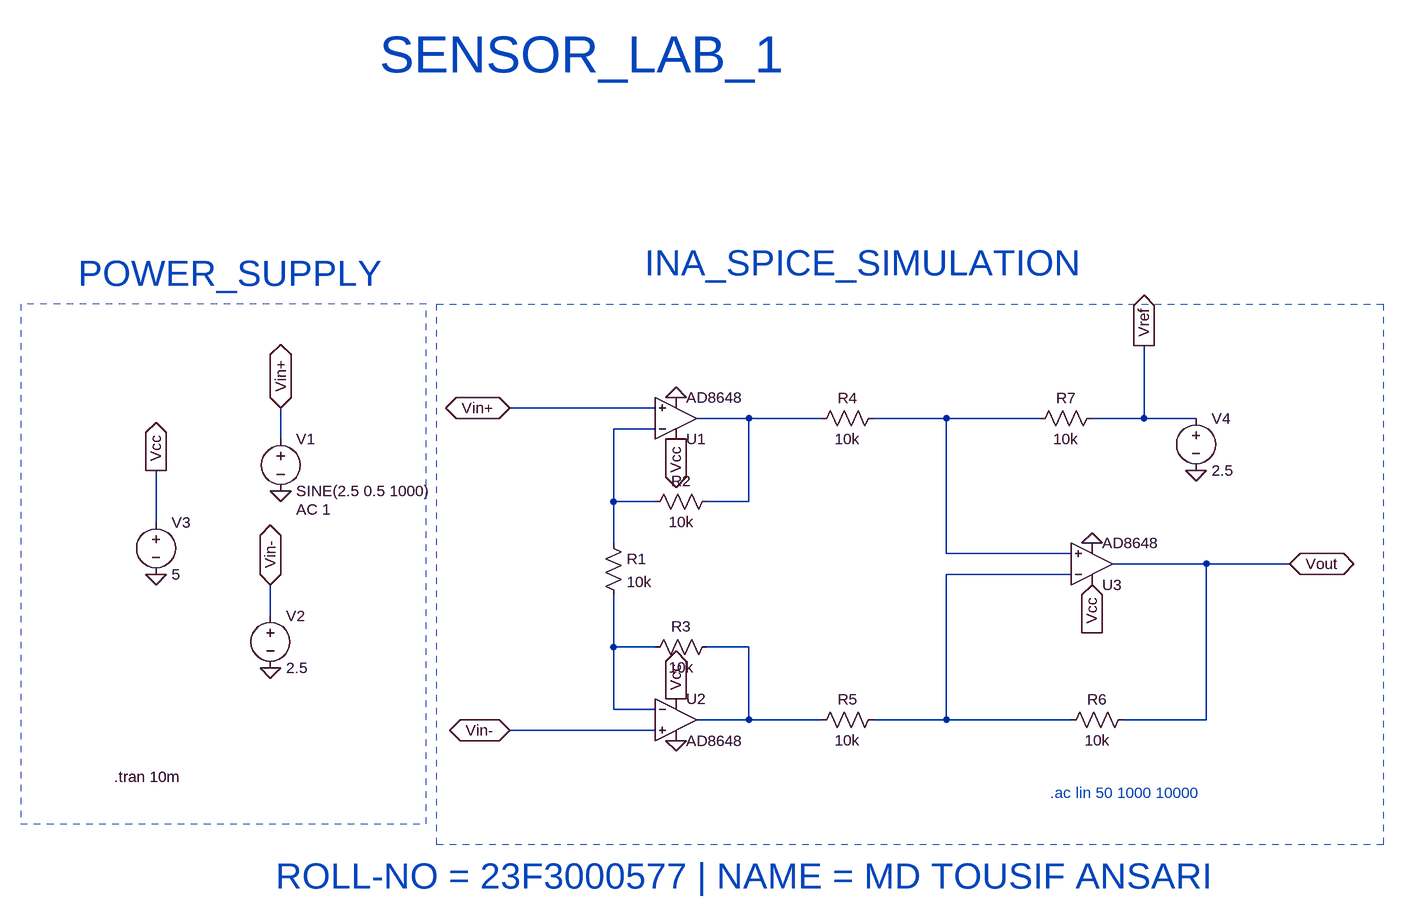
[diagram p0: schematic INST_AMP_2.asc]
INST_AMP_2.asc, the LTspice schematic file:
Version 4.1
SHEET 1 1604 772
WIRE 96 16 -128 16
WIRE 240 32 160 32
WIRE 352 32 240 32
WIRE 544 32 432 32
WIRE 688 32 544 32
WIRE 848 32 848 -80
WIRE 848 32 768 32
WIRE 928 32 848 32
WIRE 96 48 32 48
WIRE -480 64 -480 16
WIRE 32 160 32 48
WIRE 96 160 32 160
WIRE 240 160 240 32
WIRE 240 160 176 160
WIRE -672 192 -672 112
WIRE 32 224 32 160
WIRE 544 240 544 32
WIRE 736 240 544 240
WIRE 944 256 800 256
WIRE 1072 256 944 256
WIRE 736 272 544 272
WIRE -496 336 -496 288
WIRE 32 384 32 304
WIRE 96 384 32 384
WIRE 240 384 176 384
WIRE 32 480 32 384
WIRE 96 480 32 480
WIRE 240 496 240 384
WIRE 240 496 160 496
WIRE 352 496 240 496
WIRE 544 496 544 272
WIRE 544 496 432 496
WIRE 736 496 544 496
WIRE 944 496 944 256
WIRE 944 496 816 496
WIRE 96 512 -128 512
FLAG 128 0 0
FLAG 128 528 0
FLAG -480 144 0
FLAG -496 416 0
FLAG -672 272 0
FLAG -672 112 Vcc
IOPIN -672 112 Out
FLAG 128 64 Vcc
IOPIN 128 64 Out
FLAG 128 464 Vcc
IOPIN 128 464 Out
FLAG -480 16 Vin+
IOPIN -480 16 BiDir
FLAG -496 288 Vin-
IOPIN -496 288 BiDir
FLAG -128 16 Vin+
IOPIN -128 16 BiDir
FLAG -128 512 Vin-
IOPIN -128 512 BiDir
FLAG 1072 256 Vout
IOPIN 1072 256 BiDir
FLAG 768 288 Vcc
IOPIN 768 288 In
FLAG 768 224 0
FLAG 848 -80 Vref
IOPIN 848 -80 Out
FLAG 928 112 0
SYMBOL OpAmps\\AD8648 128 432 R0
SYMATTR InstName U2
SYMBOL OpAmps\\AD8648 128 96 M180
SYMATTR InstName U1
SYMBOL res 16 208 R0
SYMATTR InstName R1
SYMATTR Value 10k
SYMBOL res 192 144 R90
WINDOW 0 0 56 VBottom 2
WINDOW 3 32 56 VTop 2
SYMATTR InstName R2
SYMATTR Value 10k
SYMBOL res 192 368 R90
WINDOW 0 0 56 VBottom 2
WINDOW 3 32 56 VTop 2
SYMATTR InstName R3
SYMATTR Value 10k
SYMBOL res 448 16 R90
WINDOW 0 0 56 VBottom 2
WINDOW 3 32 56 VTop 2
SYMATTR InstName R4
SYMATTR Value 10k
SYMBOL res 448 480 R90
WINDOW 0 0 56 VBottom 2
WINDOW 3 32 56 VTop 2
SYMATTR InstName R5
SYMATTR Value 10k
SYMBOL res 784 16 R90
WINDOW 0 0 56 VBottom 2
WINDOW 3 32 56 VTop 2
SYMATTR InstName R7
SYMATTR Value 10k
SYMBOL voltage -480 48 R0
WINDOW 123 24 124 Left 2
WINDOW 39 0 0 Left 0
SYMATTR Value2 AC 1
SYMATTR InstName V1
SYMATTR Value SINE(2.5 0.5 1000)
SYMBOL voltage -496 320 R0
SYMATTR InstName V2
SYMATTR Value 2.5
SYMBOL voltage -672 176 R0
SYMATTR InstName V3
SYMATTR Value 5
SYMBOL OpAmps\\AD8648 768 320 M180
SYMATTR InstName U3
SYMBOL res 832 480 R90
WINDOW 0 0 56 VBottom 2
WINDOW 3 32 56 VTop 2
SYMATTR InstName R6
SYMATTR Value 10k
SYMBOL voltage 928 16 R0
SYMATTR InstName V4
SYMATTR Value 2.5
TEXT -736 584 Left 2 !.tran 10m
TEXT 704 608 Left 2 ;.ac lin 50 1000 10000
TEXT -792 -192 Left 5 ;POWER_SUPPLY
TEXT 80 -208 Left 5 ;INA_SPICE_SIMULATION
TEXT -328 -528 Left 6 ;SENSOR_LAB_1
TEXT -488 736 Left 5 ;ROLL-NO = 23F3000577 | NAME = MD TOUSIF ANSARI
RECTANGLE Normal -880 656 -256 -144 2
RECTANGLE Normal 1216 688 -240 -144 2

The netlist it stands for:
* INST_AMP_2.asc
X§U2 Vin- N005 Vcc 0 N006 AD8648  ; pins In+ In- V+ V- OUT
X§U1 Vin+ N003 Vcc 0 N001 AD8648  ; pins In+ In- V+ V- OUT
R1 N003 N005 10k
R2 N001 N003 10k
R3 N006 N005 10k
R4 N002 N001 10k
R5 N004 N006 10k
R7 Vref N002 10k
V1 Vin+ 0 SINE(2.5 0.5 1000) AC 1
V2 Vin- 0 2.5
V3 Vcc 0 5
X§U3 N002 N004 Vcc 0 Vout AD8648  ; pins In+ In- V+ V- OUT
R6 Vout N004 10k
V4 Vref 0 2.5
.tran 10m
* .ac lin 50 1000 10000
* POWER_SUPPLY
* INA_SPICE_SIMULATION
* SENSOR_LAB_1
* ROLL-NO = 23F3000577 | NAME = MD TOUSIF ANSARI
.lib ADI.lib
.backanno
.end